# EAGLE design Joy2PS2_Adapter (EAGLE 7.6.0)
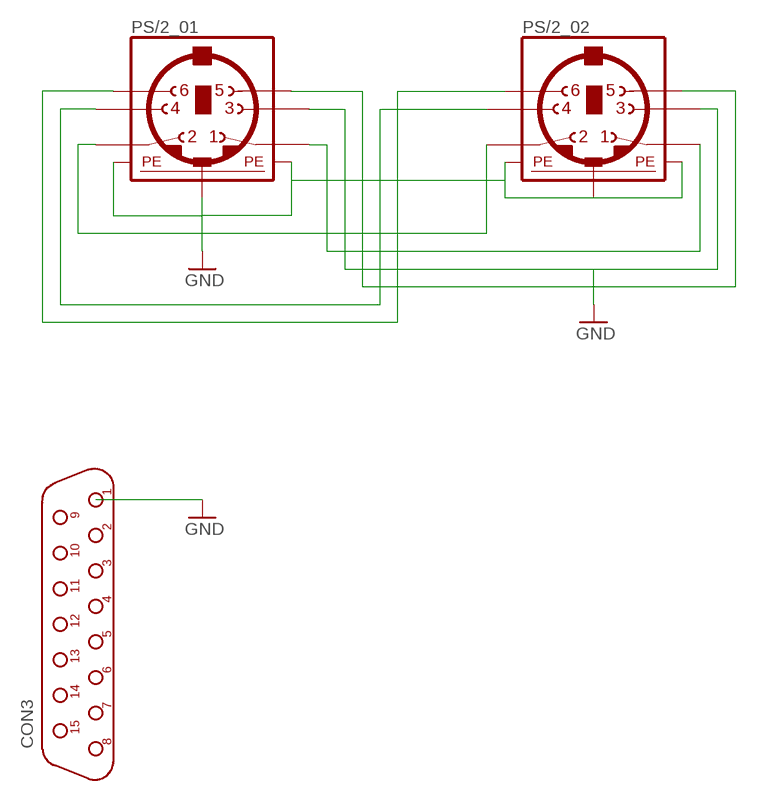
[diagram p0: schematic, sheet 1]

## Parts
CON3  DB15F/90  [D-15F/90]
PS/2_01  MINI_DIN_6  [M_DIN6]
PS/2_02  MINI_DIN_6  [M_DIN6]

## Nets
GND: CON3.1 PS/2_01.3 PS/2_01.SH1(PE1) PS/2_01.SH2(PE2) PS/2_01.SH3(PE3) PS/2_02.3 PS/2_02.SH1(PE1) PS/2_02.SH2(PE2) PS/2_02.SH3(PE3)
N$1: PS/2_01.1 PS/2_02.1
N$2: PS/2_01.2 PS/2_02.2
N$3: PS/2_01.4 PS/2_02.4
N$5: PS/2_01.5 PS/2_02.5
N$20: PS/2_01.6 PS/2_02.6
Unconnected: CON3.2 CON3.3 CON3.4 CON3.5 CON3.6 CON3.7 CON3.8 CON3.9 CON3.10 CON3.11 CON3.12 CON3.13 CON3.14 CON3.15

## Library data of the parts
CON3 = connect:DB15F/90
PS/2_01 PS/2_02 = mini_din:MINI_DIN_6

## Board
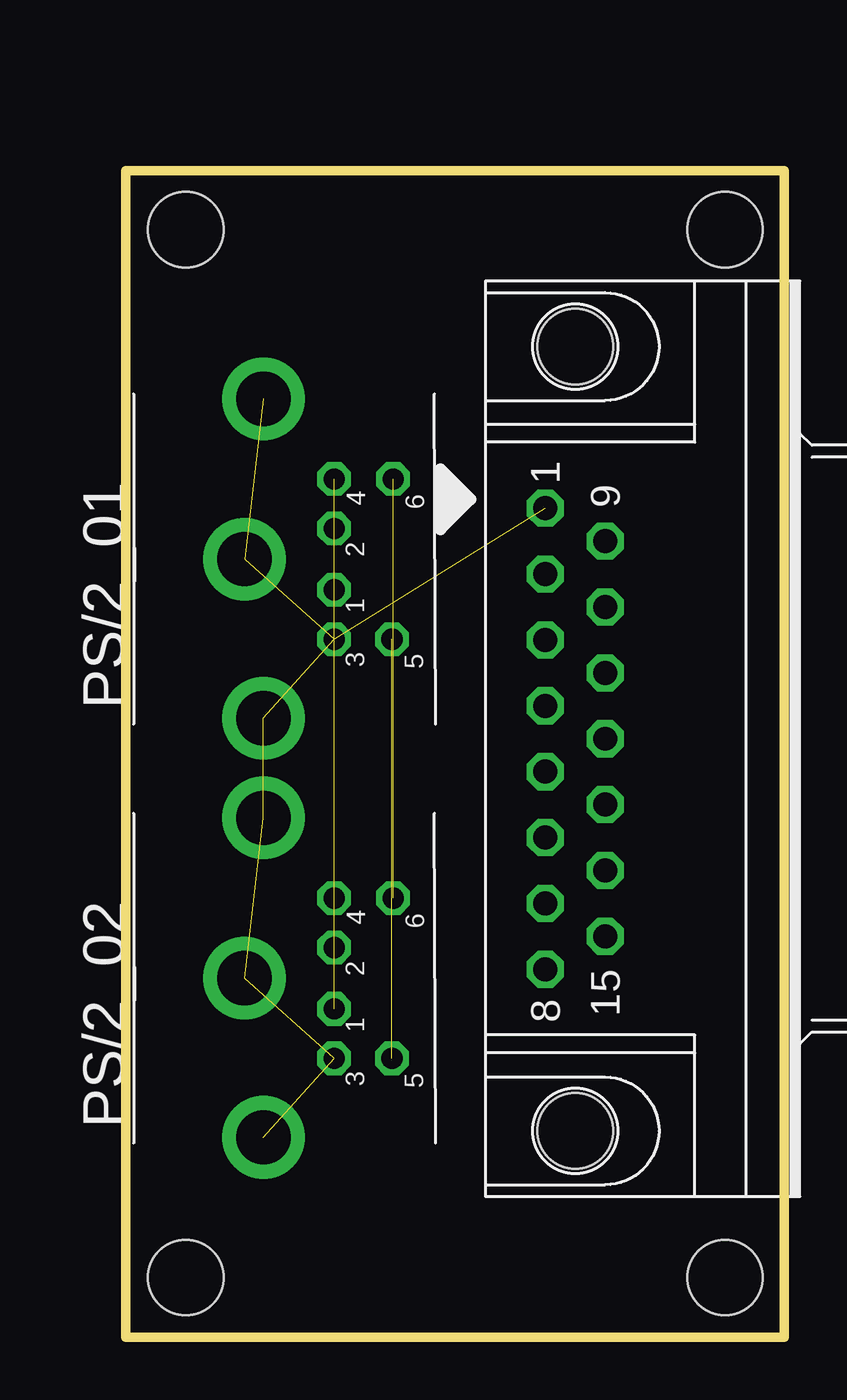
[diagram p1: board, top side]
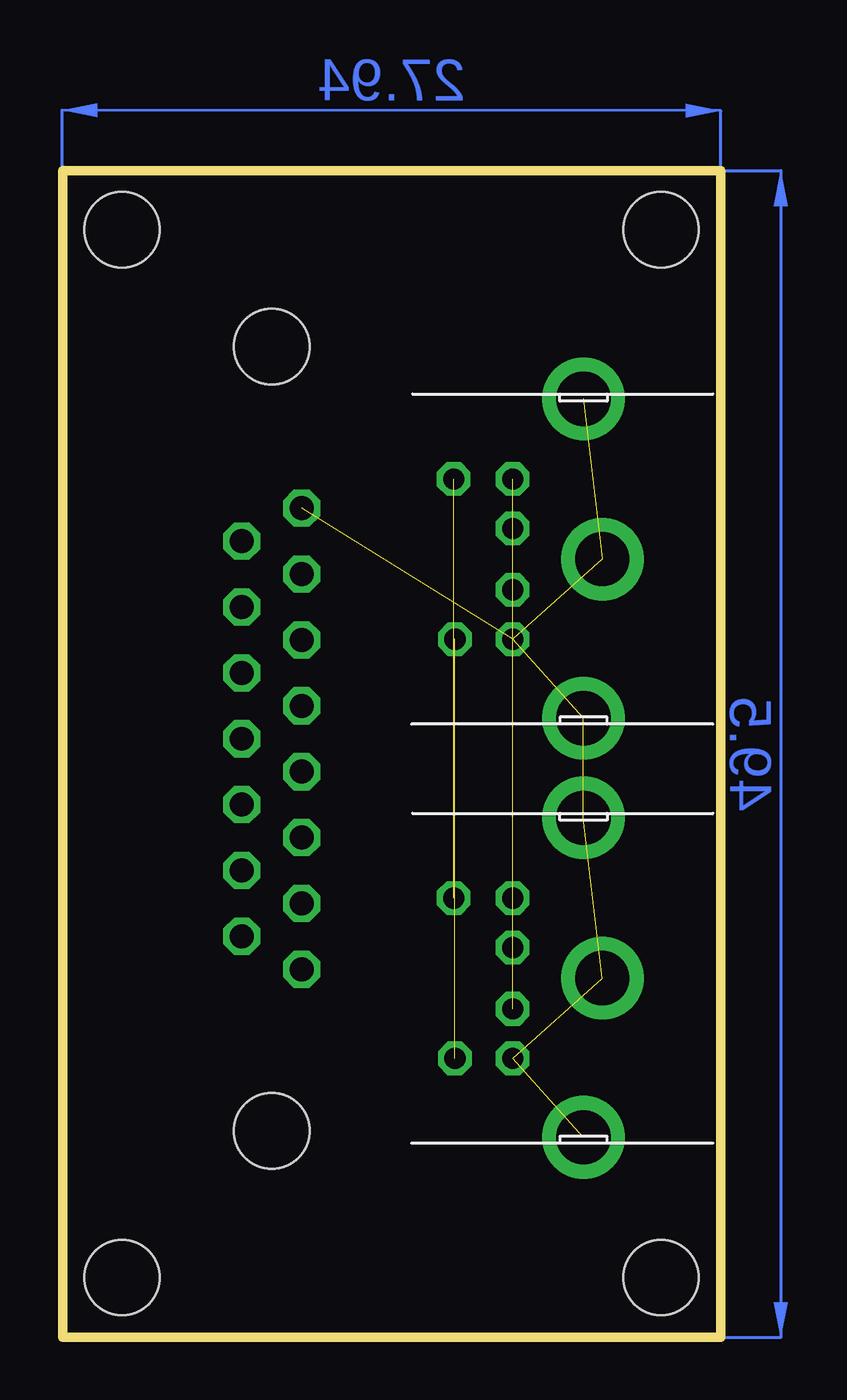
[diagram p2: board, bottom side, seen from below]

Size 27.91 x 49.5 mm. Coordinates in mm from the lower left corner, seen from the top.
Outline: 0,0 27.91,0 27.91,49.5 0,49.5 0,0
Copper layers (1*16): Top 0.035mm / dielectric 1.5mm / Bottom 0.035mm
Design rules "default": minimum track width 10mil, minimum drill 24mil, track to track 8mil, track to pad 8mil, pad to pad 8mil, via to via 8mil, smd to smd 8mil, copper to edge 40mil, drill to drill 8mil, minimum pad ring 10mil, minimum via ring 8mil, stop-mask expansion 4mil, vias tented up to drill 0mil, thermal gap 10mil
Holes 3.2 mm at 25.4,46.99 25.4,2.54 2.54,46.99 2.54,2.54

### Footprints (pad centres in the part's own frame; a part is rotated, then mirrored left to right if it is on the bottom)
D-15F/90 = drill 1.016 pad 1.575 octagon: 1 -9.779,-1.27; 2 -6.985,-1.27; 3 -4.191,-1.27; 4 -1.397,-1.27; 5 1.397,-1.27; 6 4.191,-1.27; 7 6.985,-1.27; 8 9.779,-1.27; 9 -8.382,1.27; 10 -5.588,1.27; 11 -2.794,1.27; 12 0,1.27; 13 2.794,1.27; 14 5.588,1.27; 15 8.382,1.27 | hole 3.2: 16.637,0; -16.637,0
M_DIN6 = drill 0.9 pad 1.422 octagon: 1 -1.3,-3.75; 2 1.3,-3.75; 3 -3.4,-3.75; 4 3.4,-3.75; 5 -3.4,-6.2; 6 3.4,-6.25 | drill 2.3 pad 3.5: SH1 6.8,-0.75; SH2 0,0.05; SH3 -6.75,-0.75

### Placement (x,y rotation side)
CON3  19.05,25.4 270 top
PS/2_01  5.08,33.02 90 top
PS/2_02  5.08,15.24 90 top

### Tracks (layer width: path | path; a pad name or v marks a point on that pad's centre or on a via)
GND  (8 unrouted)
N$1  (1 unrouted)
N$2  (1 unrouted)
N$3  (1 unrouted)
  Bottom 0.254: 8.91,18.47 PS/2_02.4
N$5  (1 unrouted)
N$20  (1 unrouted)
(copper drawn outside any net)
  shapes: Bottom area x2